# Altium schematic sheet EEG Inputs.SchDoc
size A4; SheetNumber: 4; SheetTotal: 5
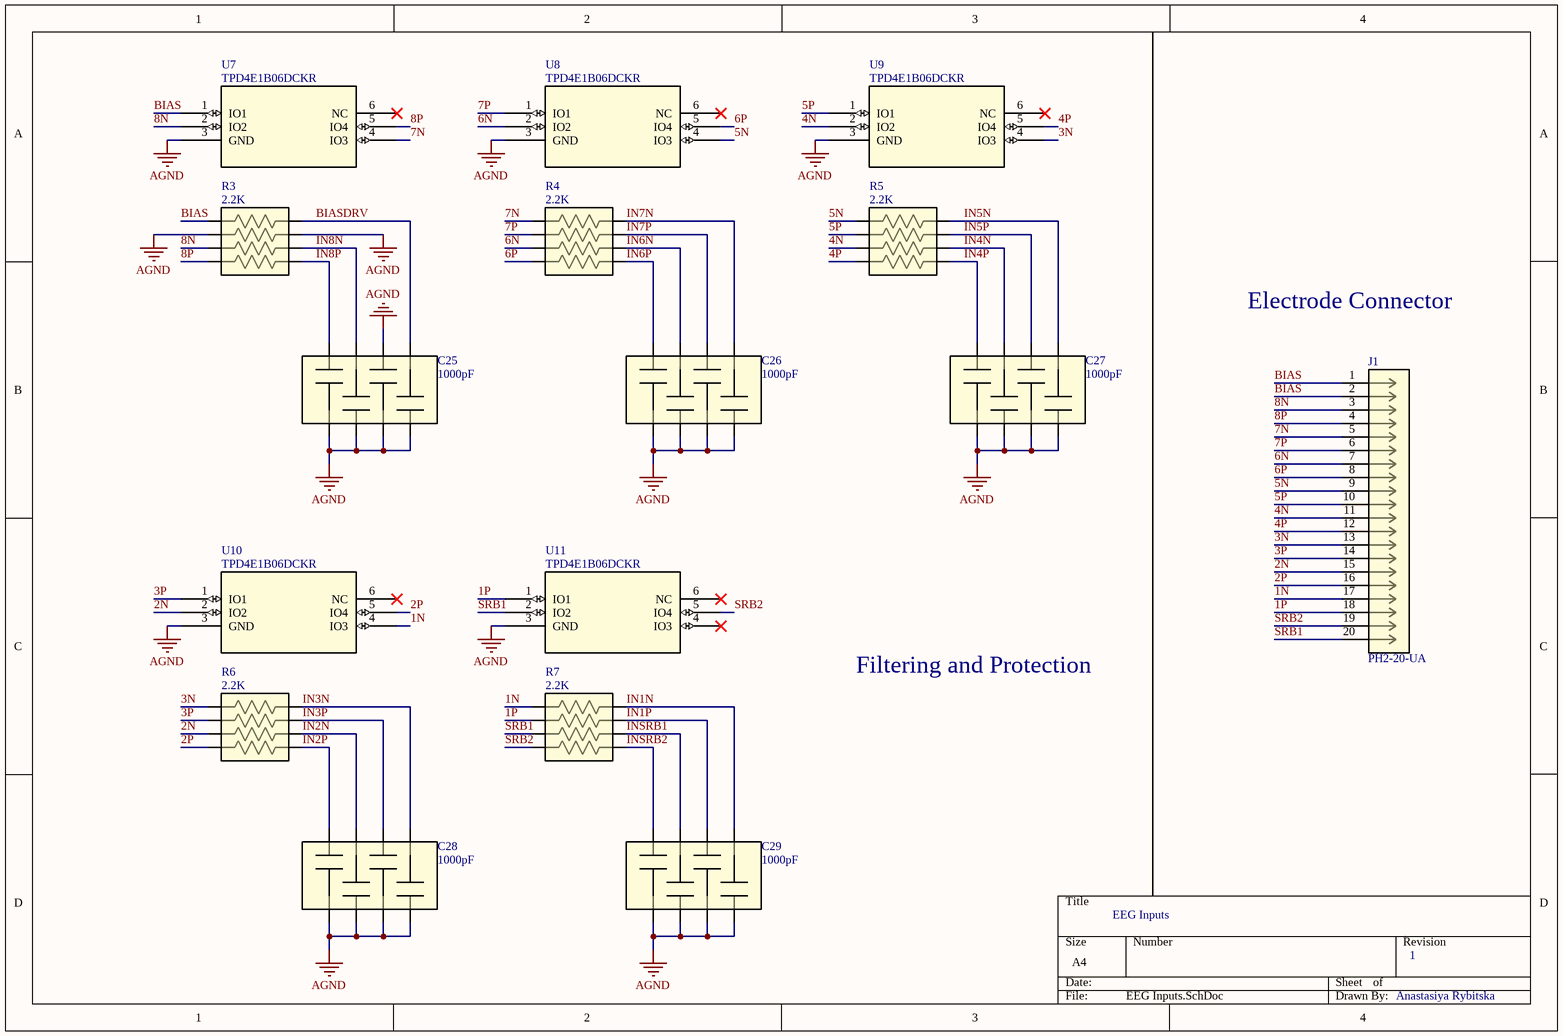
[diagram p0: EEG Inputs.SchDoc]

## Parts
C25  Capacitance: 1000pF  [CAP_CA0612_3P2X1P6_YAG]  (hidden comment: CA0612KRX7R9BB102)
C26  Capacitance: 1000pF  [CAP_CA0612_3P2X1P6_YAG]  (hidden comment: CA0612KRX7R9BB102)
C27  Capacitance: 1000pF  [CAP_CA0612_3P2X1P6_YAG]  (hidden comment: CA0612KRX7R9BB102)
C28  Capacitance: 1000pF  [CAP_CA0612_3P2X1P6_YAG]  (hidden comment: CA0612KRX7R9BB102)
C29  Capacitance: 1000pF  [CAP_CA0612_3P2X1P6_YAG]  (hidden comment: CA0612KRX7R9BB102)
J1  PH2-20-UA  [CONN_PH2-20-UA_ADM]
R3  Resistance: 2.2K  [CAY16_BRN]  (hidden comment: CAY16-2201F4LF)
R4  Resistance: 2.2K  [CAY16_BRN]  (hidden comment: CAY16-2201F4LF)
R5  Resistance: 2.2K  [CAY16_BRN]  (hidden comment: CAY16-2201F4LF)
R6  Resistance: 2.2K  [CAY16_BRN]  (hidden comment: CAY16-2201F4LF)
R7  Resistance: 2.2K  [CAY16_BRN]  (hidden comment: CAY16-2201F4LF)
U7  TPD4E1B06DCKR  [DCK6_TEX]
U8  TPD4E1B06DCKR  [DCK6_TEX]
U9  TPD4E1B06DCKR  [DCK6_TEX]
U10  TPD4E1B06DCKR  [DCK6_TEX]
U11  TPD4E1B06DCKR  [DCK6_TEX]

## Nets
AGND: C25.1 C25.2 C25.3 C25.4 C25.6 C26.1 C26.2 C26.3 C26.4 C27.1 C27.2 C27.3 C27.4 C28.1 C28.2 C28.3 C28.4 C29.1 C29.2 C29.3 C29.4 R3.2 R3.7 U7.3(GND) U8.3(GND) U9.3(GND) U10.3(GND) U11.3(GND)
1N: J1.17 R7.1 U10.4(IO3)
1P: J1.18 R7.2 U11.1(IO1)
2N: J1.15 R6.3 U10.2(IO2)
2P: J1.16 R6.4 U10.5(IO4)
3N: J1.13 R6.1 U9.4(IO3)
3P: J1.14 R6.2 U10.1(IO1)
4N: J1.11 R5.3 U9.2(IO2)
4P: J1.12 R5.4 U9.5(IO4)
5N: J1.9 R5.1 U8.4(IO3)
5P: J1.10 R5.2 U9.1(IO1)
6N: J1.7 R4.3 U8.2(IO2)
6P: J1.8 R4.4 U8.5(IO4)
7N: J1.5 R4.1 U7.4(IO3)
7P: J1.6 R4.2 U8.1(IO1)
8N: J1.3 R3.3 U7.2(IO2)
8P: J1.4 R3.4 U7.5(IO4)
BIAS: J1.1 J1.2 R3.1 U7.1(IO1)
BIASDRV: C25.5 R3.8
IN1N: C29.5 R7.8
IN1P: C29.6 R7.7
IN2N: C28.7 R6.6
IN2P: C28.8 R6.5
IN3N: C28.5 R6.8
IN3P: C28.6 R6.7
IN4N: C27.7 R5.6
IN4P: C27.8 R5.5
IN5N: C27.5 R5.8
IN5P: C27.6 R5.7
IN6N: C26.7 R4.6
IN6P: C26.8 R4.5
IN7N: C26.5 R4.8
IN7P: C26.6 R4.7
IN8N: C25.7 R3.6
IN8P: C25.8 R3.5
INSRB1: C29.7 R7.6
INSRB2: C29.8 R7.5
SRB1: J1.20 R7.3 U11.2(IO2)
SRB2: J1.19 R7.4 U11.5(IO4)

Not connected (* = marked no-connect by the designer): U7 6(NC)*; U8 6(NC)*; U9 6(NC)*; U10 6(NC)*; U11 4(IO3)* 6(NC)*

## Notes on the sheet
- Electrode Connector
- Filtering and Protection
- EEG Inputs
- 1
- Anastasiya Rybitska

## Library data of the parts
J1 = PH2-20-UA: No Description Available; Mfr_Name: ADAM TECHNOLOGIES INC; Type: DEV; Copyright: Copyright (C) 2024 Ultra Librarian. All rights reserved.; Manufacturer_Part_Number: PH2-20-UA; RefDes: RefDes
R3-R7 = CAY16-2201F4LF: No Description Available; Mfr_Name: Bourns Electronics; Type: DEV; Copyright: Copyright (C) 2023 Ultra Librarian. All rights reserved.; Manufacturer_Part_Number: CAY16-2201F4LF; RefDes: RefDes
U7-U11 = TPD4E1B06DCKR: No Description Available; Mfr_Name: Texas Instruments; Copyright: Copyright (C) 2023 Ultra Librarian. All rights reserved.; Manufacturer_Part_Number: TPD4E1B06DCKR; RefDes: RefDes; Type: DEV